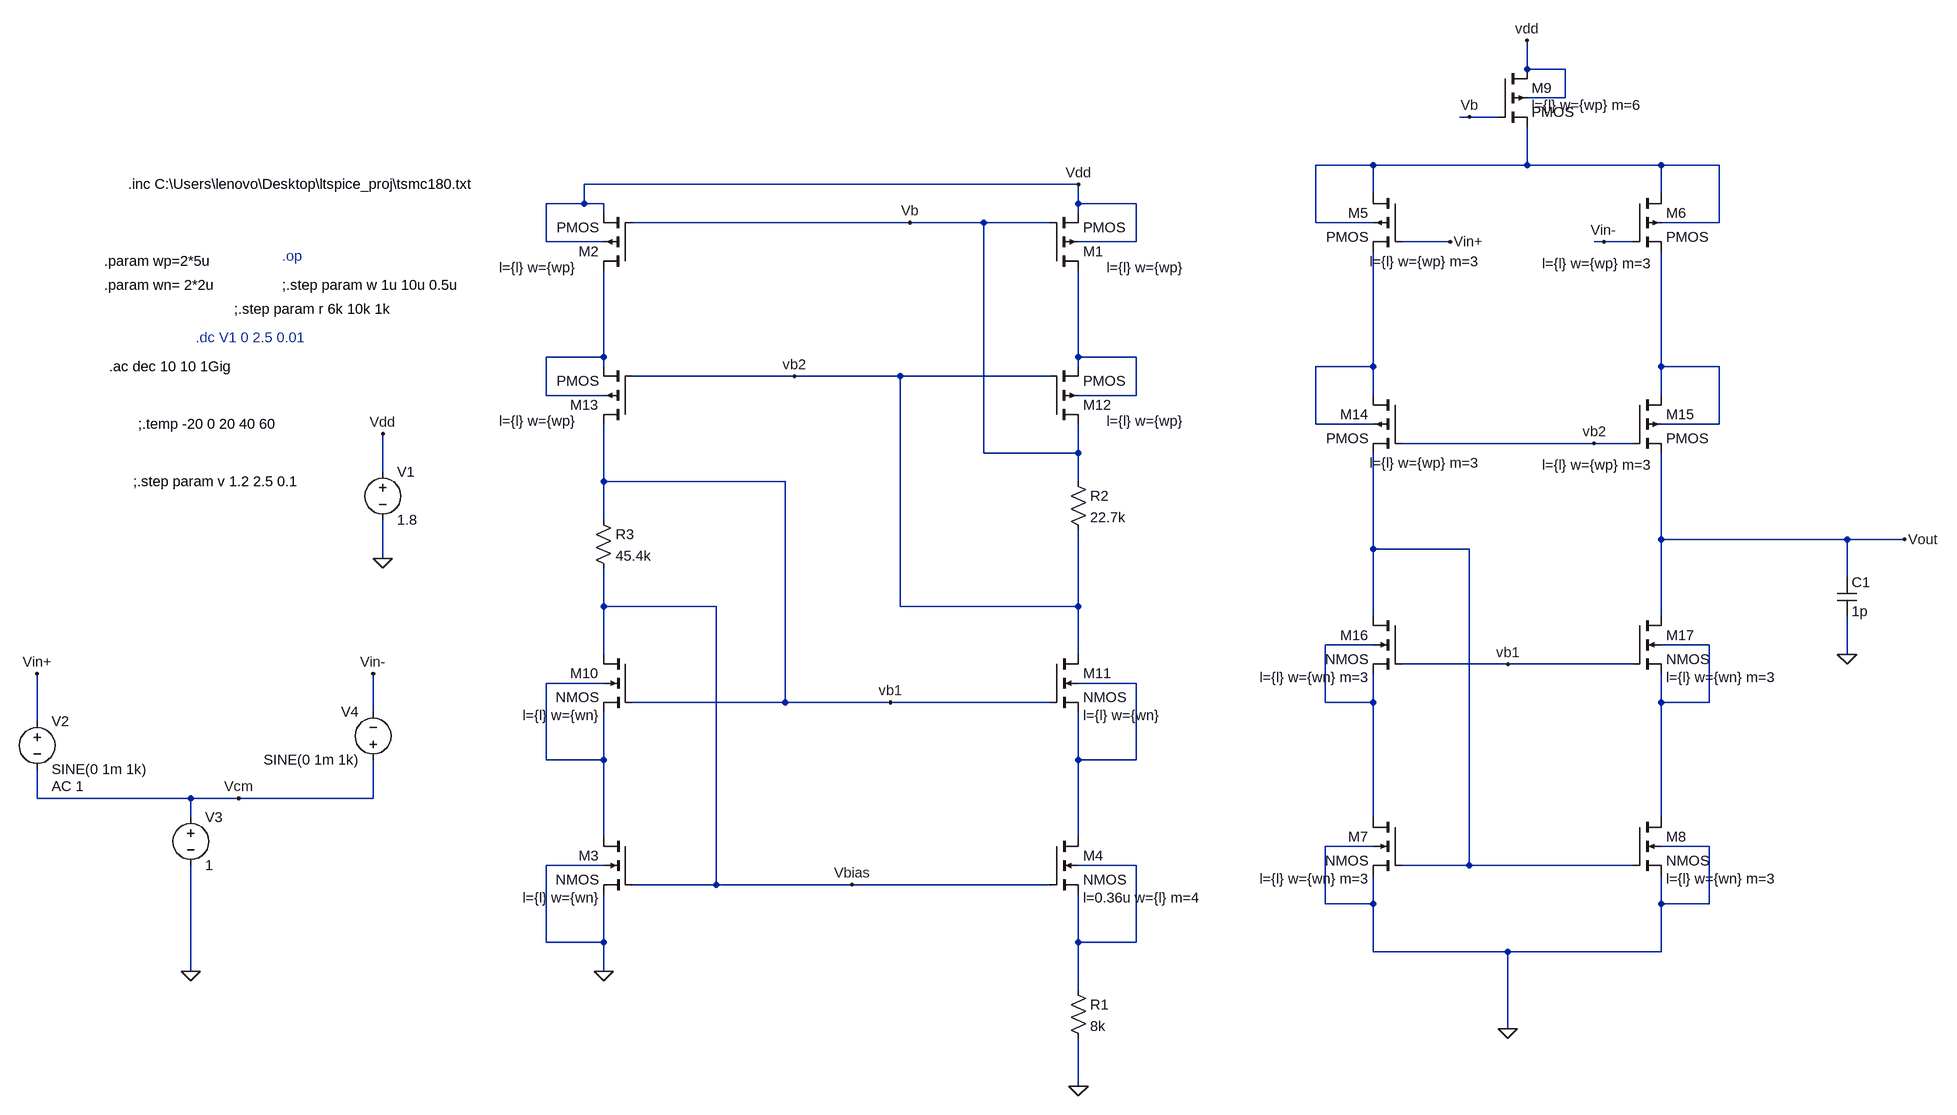
[diagram p0: schematic pmos-telescopic.asc]
pmos-telescopic.asc, the LTspice schematic file:
Version 4
SHEET 1 1904 1220
WIRE 1184 -1120 1184 -1168
WIRE 1248 -1120 1184 -1120
WIRE 1248 -1072 1248 -1120
WIRE 1248 -1072 1184 -1072
WIRE 1088 -1040 1072 -1040
WIRE 1136 -1040 1088 -1040
WIRE 928 -960 832 -960
WIRE 1184 -960 1184 -1024
WIRE 1184 -960 928 -960
WIRE 1408 -960 1184 -960
WIRE 1504 -960 1408 -960
WIRE 48 -928 -992 -928
WIRE 928 -912 928 -960
WIRE 1408 -912 1408 -960
WIRE -992 -896 -992 -928
WIRE -992 -896 -1056 -896
WIRE -960 -896 -992 -896
WIRE 48 -896 48 -928
WIRE 144 -896 48 -896
WIRE -960 -880 -960 -896
WIRE 48 -880 48 -896
WIRE -368 -864 -912 -864
WIRE -240 -864 -368 -864
WIRE 0 -864 -240 -864
WIRE 832 -864 832 -960
WIRE 928 -864 832 -864
WIRE 1504 -864 1504 -960
WIRE 1504 -864 1408 -864
WIRE -1056 -832 -1056 -896
WIRE -960 -832 -1056 -832
WIRE 144 -832 144 -896
WIRE 144 -832 48 -832
WIRE 1056 -832 976 -832
WIRE 1312 -832 1296 -832
WIRE 1360 -832 1312 -832
WIRE -960 -640 -960 -784
WIRE -960 -640 -1056 -640
WIRE 48 -640 48 -784
WIRE 144 -640 48 -640
WIRE -960 -624 -960 -640
WIRE 48 -624 48 -640
WIRE 928 -624 928 -816
WIRE 928 -624 832 -624
WIRE 1408 -624 1408 -816
WIRE 1504 -624 1408 -624
WIRE -560 -608 -912 -608
WIRE -384 -608 -560 -608
WIRE 0 -608 -384 -608
WIRE -1056 -576 -1056 -640
WIRE -960 -576 -1056 -576
WIRE 144 -576 144 -640
WIRE 144 -576 48 -576
WIRE 928 -576 928 -624
WIRE 1408 -576 1408 -624
WIRE 832 -528 832 -624
WIRE 928 -528 832 -528
WIRE 1504 -528 1504 -624
WIRE 1504 -528 1408 -528
WIRE 1296 -496 976 -496
WIRE 1360 -496 1296 -496
WIRE -240 -480 -240 -864
WIRE 48 -480 48 -528
WIRE 48 -480 -240 -480
WIRE -1328 -448 -1328 -512
WIRE -960 -432 -960 -528
WIRE -576 -432 -960 -432
WIRE 48 -432 48 -480
WIRE -960 -368 -960 -432
WIRE 1408 -336 1408 -480
WIRE 1744 -336 1408 -336
WIRE 1840 -336 1744 -336
WIRE 928 -320 928 -480
WIRE 1088 -320 928 -320
WIRE -1328 -304 -1328 -368
WIRE 1744 -272 1744 -336
WIRE -960 -224 -960 -288
WIRE -752 -224 -960 -224
WIRE -384 -224 -384 -608
WIRE 48 -224 48 -352
WIRE 48 -224 -384 -224
WIRE 928 -208 928 -320
WIRE 1408 -208 1408 -336
WIRE 928 -160 848 -160
WIRE 1488 -160 1408 -160
WIRE -960 -144 -960 -224
WIRE 48 -144 48 -224
WIRE 1744 -144 1744 -208
WIRE 1152 -128 976 -128
WIRE 1360 -128 1152 -128
WIRE -960 -96 -1056 -96
WIRE 144 -96 48 -96
WIRE -576 -64 -576 -432
WIRE -576 -64 -912 -64
WIRE -400 -64 -576 -64
WIRE 0 -64 -400 -64
WIRE 848 -64 848 -160
WIRE 928 -64 928 -112
WIRE 928 -64 848 -64
WIRE 1408 -64 1408 -112
WIRE 1488 -64 1488 -160
WIRE 1488 -64 1408 -64
WIRE -1344 -48 -1344 -112
WIRE -1904 -32 -1904 -112
WIRE -1056 32 -1056 -96
WIRE -960 32 -960 -48
WIRE -960 32 -1056 32
WIRE 48 32 48 -48
WIRE 144 32 144 -96
WIRE 144 32 48 32
WIRE -1904 96 -1904 48
WIRE -1648 96 -1904 96
WIRE -1568 96 -1648 96
WIRE -1344 96 -1344 32
WIRE -1344 96 -1568 96
WIRE -1648 128 -1648 96
WIRE 928 128 928 -64
WIRE 1408 128 1408 -64
WIRE -960 160 -960 32
WIRE 48 160 48 32
WIRE 928 176 848 176
WIRE 1488 176 1408 176
WIRE -960 208 -1056 208
WIRE 144 208 48 208
WIRE 1088 208 1088 -320
WIRE 1088 208 976 208
WIRE 1360 208 1088 208
WIRE -752 240 -752 -224
WIRE -752 240 -912 240
WIRE -464 240 -752 240
WIRE 0 240 -464 240
WIRE 848 272 848 176
WIRE 928 272 928 224
WIRE 928 272 848 272
WIRE 1408 272 1408 224
WIRE 1488 272 1488 176
WIRE 1488 272 1408 272
WIRE -1056 336 -1056 208
WIRE -960 336 -960 256
WIRE -960 336 -1056 336
WIRE 48 336 48 256
WIRE 144 336 144 208
WIRE 144 336 48 336
WIRE 928 352 928 272
WIRE 1152 352 928 352
WIRE 1408 352 1408 272
WIRE 1408 352 1152 352
WIRE -1648 384 -1648 208
WIRE -960 384 -960 336
WIRE 48 416 48 336
WIRE 1152 480 1152 352
WIRE 48 576 48 496
FLAG -1328 -304 0
FLAG -1328 -512 Vdd
FLAG 48 -928 Vdd
FLAG -960 384 0
FLAG 48 576 0
FLAG -464 240 Vbias
FLAG -1648 384 0
FLAG -1904 -112 Vin+
FLAG -1568 96 Vcm
FLAG 1840 -336 Vout
FLAG 1744 -144 0
FLAG -400 -64 vb1
FLAG -560 -608 vb2
FLAG 1296 -496 vb2
FLAG -1344 -112 Vin-
FLAG 1152 480 0
FLAG 1184 -1168 vdd
FLAG 1056 -832 Vin+
FLAG 1312 -832 Vin-
FLAG 1152 -128 vb1
FLAG -368 -864 Vb
FLAG 1088 -1040 Vb
DATAFLAG 48 384 ""
DATAFLAG -112 240 ""
DATAFLAG -720 -864 ""
DATAFLAG 1296 352 ""
DATAFLAG 1264 -960 ""
DATAFLAG -112 -64 ""
DATAFLAG -720 -608 ""
DATAFLAG 1184 -496 ""
DATAFLAG 1216 -128 ""
DATAFLAG 1584 -336 ""
SYMBOL pmos4 0 -784 M180
WINDOW 123 95 5 Left 2
SYMATTR Value2 l={l} w={wp}
SYMATTR InstName M1
SYMBOL voltage -1328 -464 R0
SYMATTR InstName V1
SYMATTR Value 1.8
SYMBOL pmos4 -912 -784 R180
WINDOW 123 95 5 Left 2
SYMATTR Value2 l={l} w={wp}
SYMATTR InstName M2
SYMBOL nmos4 -912 160 M0
WINDOW 123 56 102 Left 2
SYMATTR Value2 l={l} w={wn}
SYMATTR InstName M3
SYMBOL nmos4 0 160 R0
WINDOW 123 56 102 Left 2
SYMATTR Value2 l=0.36u w={l} m=4
SYMATTR InstName M4
SYMBOL res 32 400 R0
SYMATTR InstName R1
SYMATTR Value 8k
SYMBOL pmos4 976 -912 M0
WINDOW 123 -127 113 Left 2
SYMATTR Value2 l={l} w={wp} m=3
SYMATTR InstName M5
SYMBOL pmos4 1360 -912 R0
WINDOW 123 -151 116 Left 2
SYMATTR Value2 l={l} w={wp} m=3
SYMATTR InstName M6
SYMBOL nmos4 976 128 M0
WINDOW 123 56 102 Left 2
SYMATTR Value2 l={l} w={wn} m=3
SYMATTR InstName M7
SYMBOL nmos4 1360 128 R0
WINDOW 123 56 102 Left 2
SYMATTR Value2 l={l} w={wn} m=3
SYMATTR InstName M8
SYMBOL voltage -1904 -48 R0
WINDOW 123 24 124 Left 2
WINDOW 39 0 0 Left 0
SYMATTR Value2 AC 1
SYMATTR InstName V2
SYMATTR Value SINE(0 1m 1k)
SYMBOL voltage -1648 112 R0
WINDOW 123 0 0 Left 0
WINDOW 39 0 0 Left 0
SYMATTR InstName V3
SYMATTR Value 1
SYMBOL voltage -1344 48 R180
WINDOW 0 24 96 Left 2
WINDOW 3 24 16 Left 2
WINDOW 123 24 -12 Left 2
WINDOW 39 0 0 Left 0
SYMATTR InstName V4
SYMATTR Value SINE(0 1m 1k)
SYMBOL cap 1728 -272 R0
SYMATTR InstName C1
SYMATTR Value 1p
SYMBOL nmos4 -912 -144 M0
WINDOW 123 56 102 Left 2
SYMATTR Value2 l={l} w={wn}
SYMATTR InstName M10
SYMBOL nmos4 0 -144 R0
WINDOW 123 56 102 Left 2
SYMATTR Value2 l={l} w={wn}
SYMATTR InstName M11
SYMBOL pmos4 0 -528 M180
WINDOW 123 95 5 Left 2
SYMATTR Value2 l={l} w={wp}
SYMATTR InstName M12
SYMBOL pmos4 -912 -528 R180
WINDOW 123 95 5 Left 2
SYMATTR Value2 l={l} w={wp}
SYMATTR InstName M13
SYMBOL res 32 -448 R0
SYMATTR InstName R2
SYMATTR Value 22.7k
SYMBOL res -976 -384 R0
SYMATTR InstName R3
SYMATTR Value 45.4k
SYMBOL pmos4 976 -576 M0
WINDOW 123 -127 113 Left 2
SYMATTR Value2 l={l} w={wp} m=3
SYMATTR InstName M14
SYMBOL pmos4 1360 -576 R0
WINDOW 123 -151 116 Left 2
SYMATTR Value2 l={l} w={wp} m=3
SYMATTR InstName M15
SYMBOL nmos4 976 -208 M0
WINDOW 123 56 102 Left 2
SYMATTR Value2 l={l} w={wn} m=3
SYMATTR InstName M16
SYMBOL nmos4 1360 -208 R0
WINDOW 123 56 102 Left 2
SYMATTR Value2 l={l} w={wn} m=3
SYMATTR InstName M17
SYMBOL pmos4 1136 -1120 R0
WINDOW 123 56 60 Left 2
SYMATTR Value2 l={l} w={wp} m=6
SYMATTR InstName M9
TEXT -1752 -928 Left 2 !.inc C:\\Users\\lenovo\\Desktop\\ltspice_proj\\tsmc180.txt
TEXT -1496 -808 Left 2 ;.op
TEXT -1496 -760 Left 2 !;.step param w 1u 10u 0.5u
TEXT -1576 -720 Left 2 !;.step param r 6k 10k 1k
TEXT -1640 -672 Left 2 ;.dc V1 0 2.5 0.01
TEXT -1784 -624 Left 2 !.ac dec 10 10 1Gig
TEXT -1736 -528 Left 2 !;.temp -20 0 20 40 60
TEXT -1744 -432 Left 2 !;.step param v 1.2 2.5 0.1
TEXT -1792 -800 Left 2 !.param wp=2*5u
TEXT -1792 -760 Left 2 !.param wn= 2*2u

The netlist it stands for:
* pmos-telescopic.asc
M1 N003 Vb Vdd Vdd PMOS l={l} w={wp}
V1 Vdd 0 1.8
M2 N002 Vb Vdd Vdd PMOS l={l} w={wp}
M3 N009 Vbias 0 0 NMOS l={l} w={wn}
M4 N010 Vbias N011 N011 NMOS l=0.36u w={l} m=4
R1 N011 0 8k
M5 N001 Vin+ N004 N001 PMOS l={l} w={wp} m=3
M6 N001 Vin- N005 N001 PMOS l={l} w={wp} m=3
M7 N007 N006 0 0 NMOS l={l} w={wn} m=3
M8 N008 N006 0 0 NMOS l={l} w={wn} m=3
V2 Vin+ Vcm SINE(0 1m 1k) AC 1
V3 Vcm 0 1
V4 Vcm Vin- SINE(0 1m 1k)
C1 Vout 0 1p
M10 Vbias vb1 N009 N009 NMOS l={l} w={wn}
M11 vb2 vb1 N010 N010 NMOS l={l} w={wn}
M12 Vb vb2 N003 N003 PMOS l={l} w={wp}
M13 vb1 vb2 N002 N002 PMOS l={l} w={wp}
R2 Vb vb2 22.7k
R3 vb1 Vbias 45.4k
M14 N004 vb2 N006 N004 PMOS l={l} w={wp} m=3
M15 N005 vb2 Vout N005 PMOS l={l} w={wp} m=3
M16 N006 vb1 N007 N007 NMOS l={l} w={wn} m=3
M17 Vout vb1 N008 N008 NMOS l={l} w={wn} m=3
M9 Vdd Vb N001 Vdd PMOS l={l} w={wp} m=6
.model NMOS NMOS
.model PMOS PMOS
.lib standard.mos
.inc C:\Users\lenovo\Desktop\ltspice_proj\tsmc180.txt
* .op
;.step param w 1u 10u 0.5u
;.step param r 6k 10k 1k
* .dc V1 0 2.5 0.01
.ac dec 10 10 1Gig
;.temp -20 0 20 40 60
;.step param v 1.2 2.5 0.1
.param wp=2*5u
.param wn= 2*2u
.backanno
.end